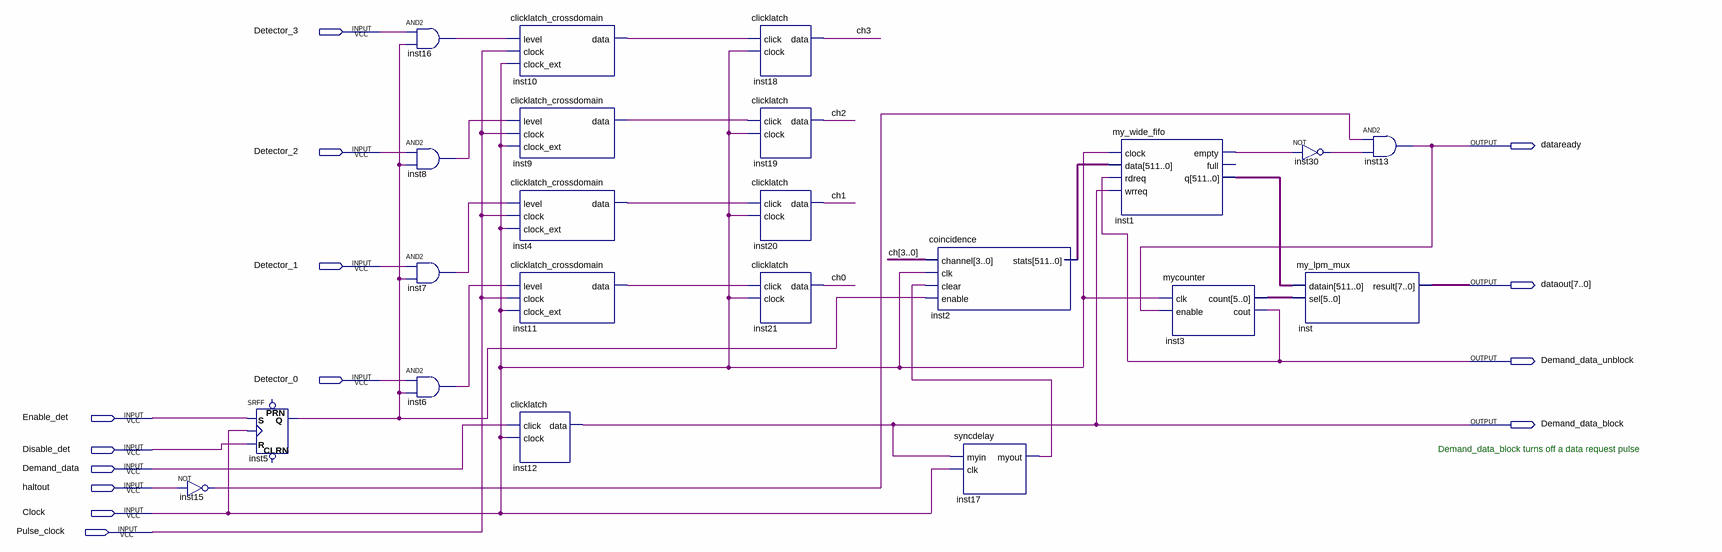
[diagram p0: schematic sheet]
// Quartus schematic apdtimer_all.bdf as structural Verilog: 22 symbols, 14 pins
module apdtimer_all (
  input  Detector_3,
  input  Detector_2,
  input  Detector_1,
  input  Detector_0,
  input  Enable_det,
  input  Disable_det,
  input  Demand_data,
  input  haltout,
  input  Clock,
  input  Pulse_clock,
  output dataready,
  output [7:0] dataout,
  output Demand_data_unblock,
  output Demand_data_block
);

  wire inst1_empty, inst4_data, inst5_q, inst6_out, inst7_out, inst8_out, inst9_data, inst10_data,
       inst11_data, inst15_out, inst16_out, inst17_myout, inst30_out;
  wire [3:0] ch;
  wire [5:0] inst3_count;
  wire [511:0] inst1_q, inst2_stats;

  not inst15 (inst15_out, haltout);
  SRFF inst5 (.S(Enable_det), .R(Disable_det), .CLK(Clock), .Q(inst5_q));  // open: PRN, CLRN
  and inst16 (inst16_out, Detector_3, inst5_q);
  and inst8 (inst8_out, Detector_2, inst5_q);
  and inst7 (inst7_out, Detector_1, inst5_q);
  and inst6 (inst6_out, Detector_0, inst5_q);
  clicklatch_crossdomain inst10 (.level(inst16_out), .clock(Pulse_clock), .clock_ext(Clock), .data(inst10_data));
  clicklatch_crossdomain inst9 (.level(inst8_out), .clock(Pulse_clock), .clock_ext(Clock), .data(inst9_data));
  clicklatch_crossdomain inst4 (.level(inst7_out), .clock(Pulse_clock), .clock_ext(Clock), .data(inst4_data));
  clicklatch_crossdomain inst11 (.level(inst6_out), .clock(Pulse_clock), .clock_ext(Clock), .data(inst11_data));
  clicklatch inst12 (.click(Demand_data), .clock(Clock), .data(Demand_data_block));
  clicklatch inst18 (.click(inst10_data), .clock(Clock), .data(ch[3]));
  clicklatch inst19 (.click(inst9_data), .clock(Clock), .data(ch[2]));
  clicklatch inst20 (.click(inst4_data), .clock(Clock), .data(ch[1]));
  clicklatch inst21 (.click(inst11_data), .clock(Clock), .data(ch[0]));
  coincidence inst2 (.channel(ch), .clk(Clock), .clear(inst17_myout), .enable(inst5_q), .stats(inst2_stats));
  syncdelay inst17 (.myin(Demand_data_block), .clk(Clock), .myout(inst17_myout));
  my_wide_fifo inst1 (
    .clock(Clock), .data(inst2_stats), .rdreq(Demand_data_unblock), .wrreq(Demand_data_block),
    .empty(inst1_empty), .q(inst1_q));  // open: full
  mycounter inst3 (.clk(Clock), .enable(dataready), .count(inst3_count), .cout(Demand_data_unblock));
  not inst30 (inst30_out, inst1_empty);
  my_lpm_mux inst (.datain(inst1_q), .sel(inst3_count), .result(dataout));
  and inst13 (dataready, inst15_out, inst30_out);

  // Notes on the sheet:
  //   Demand_data_block turns off a data request pulse
endmodule
